# EAGLE design hdmi_lvds_converter (EAGLE 9.6.1)
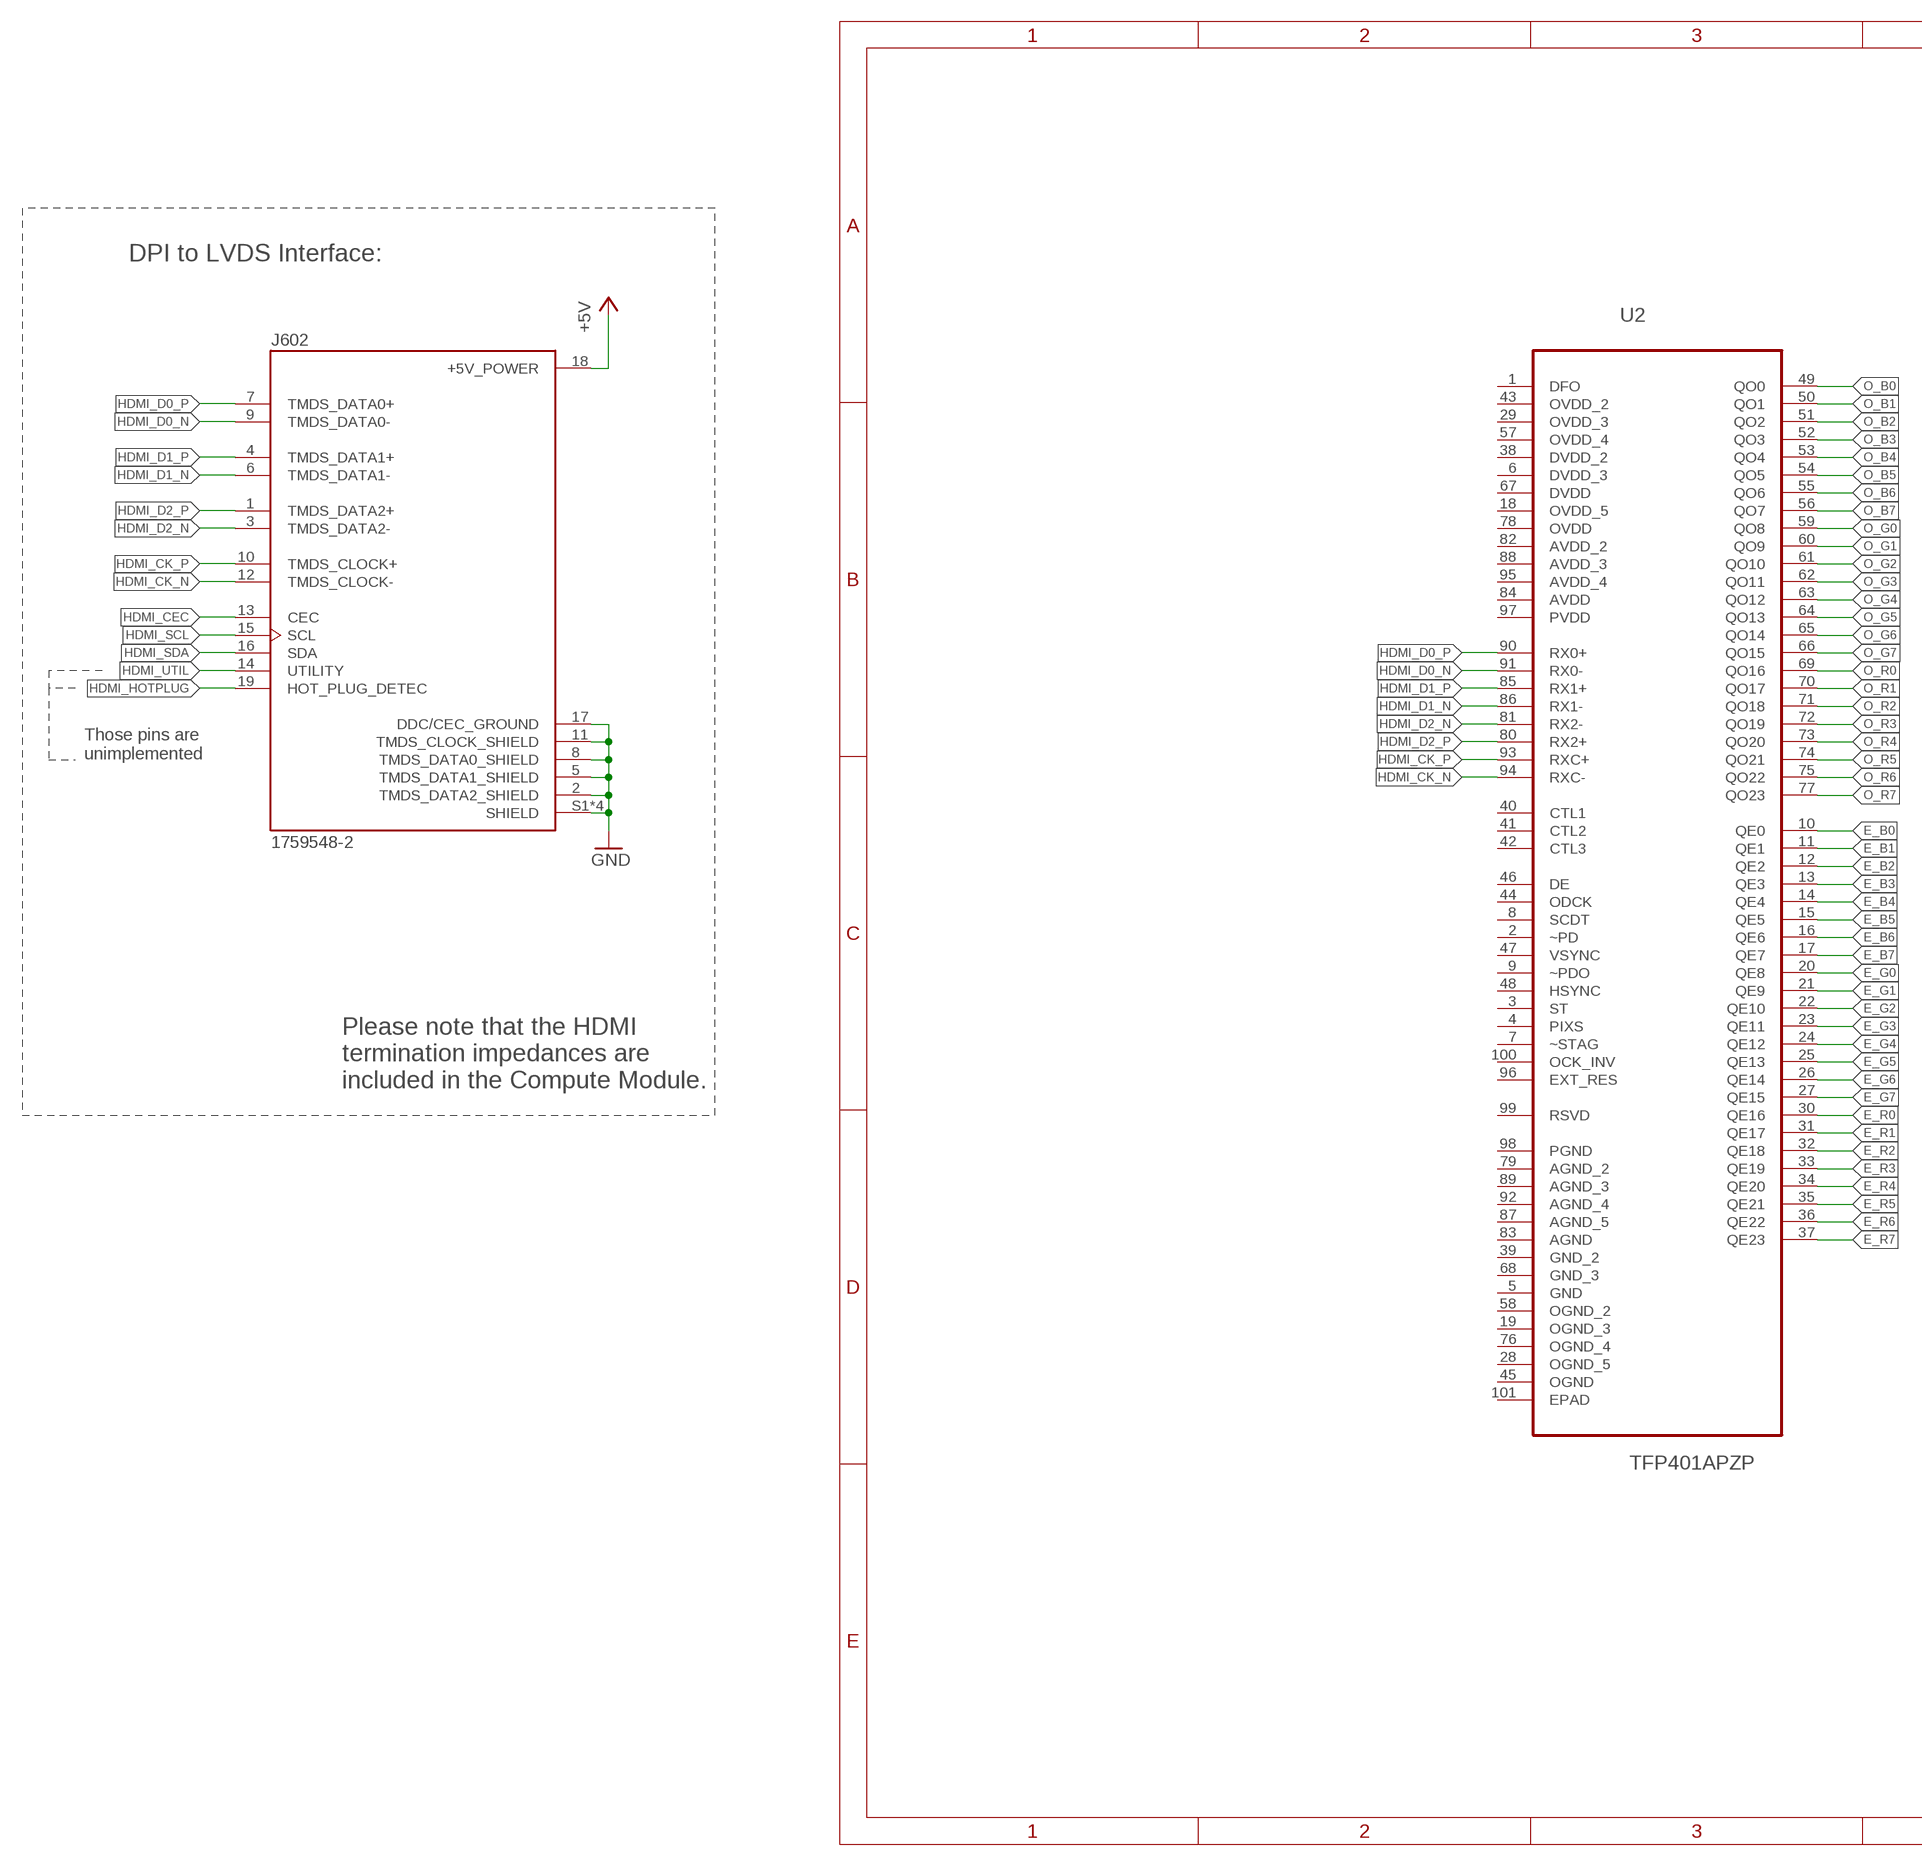
[diagram p0: schematic, sheet 1, part 1 of 2]
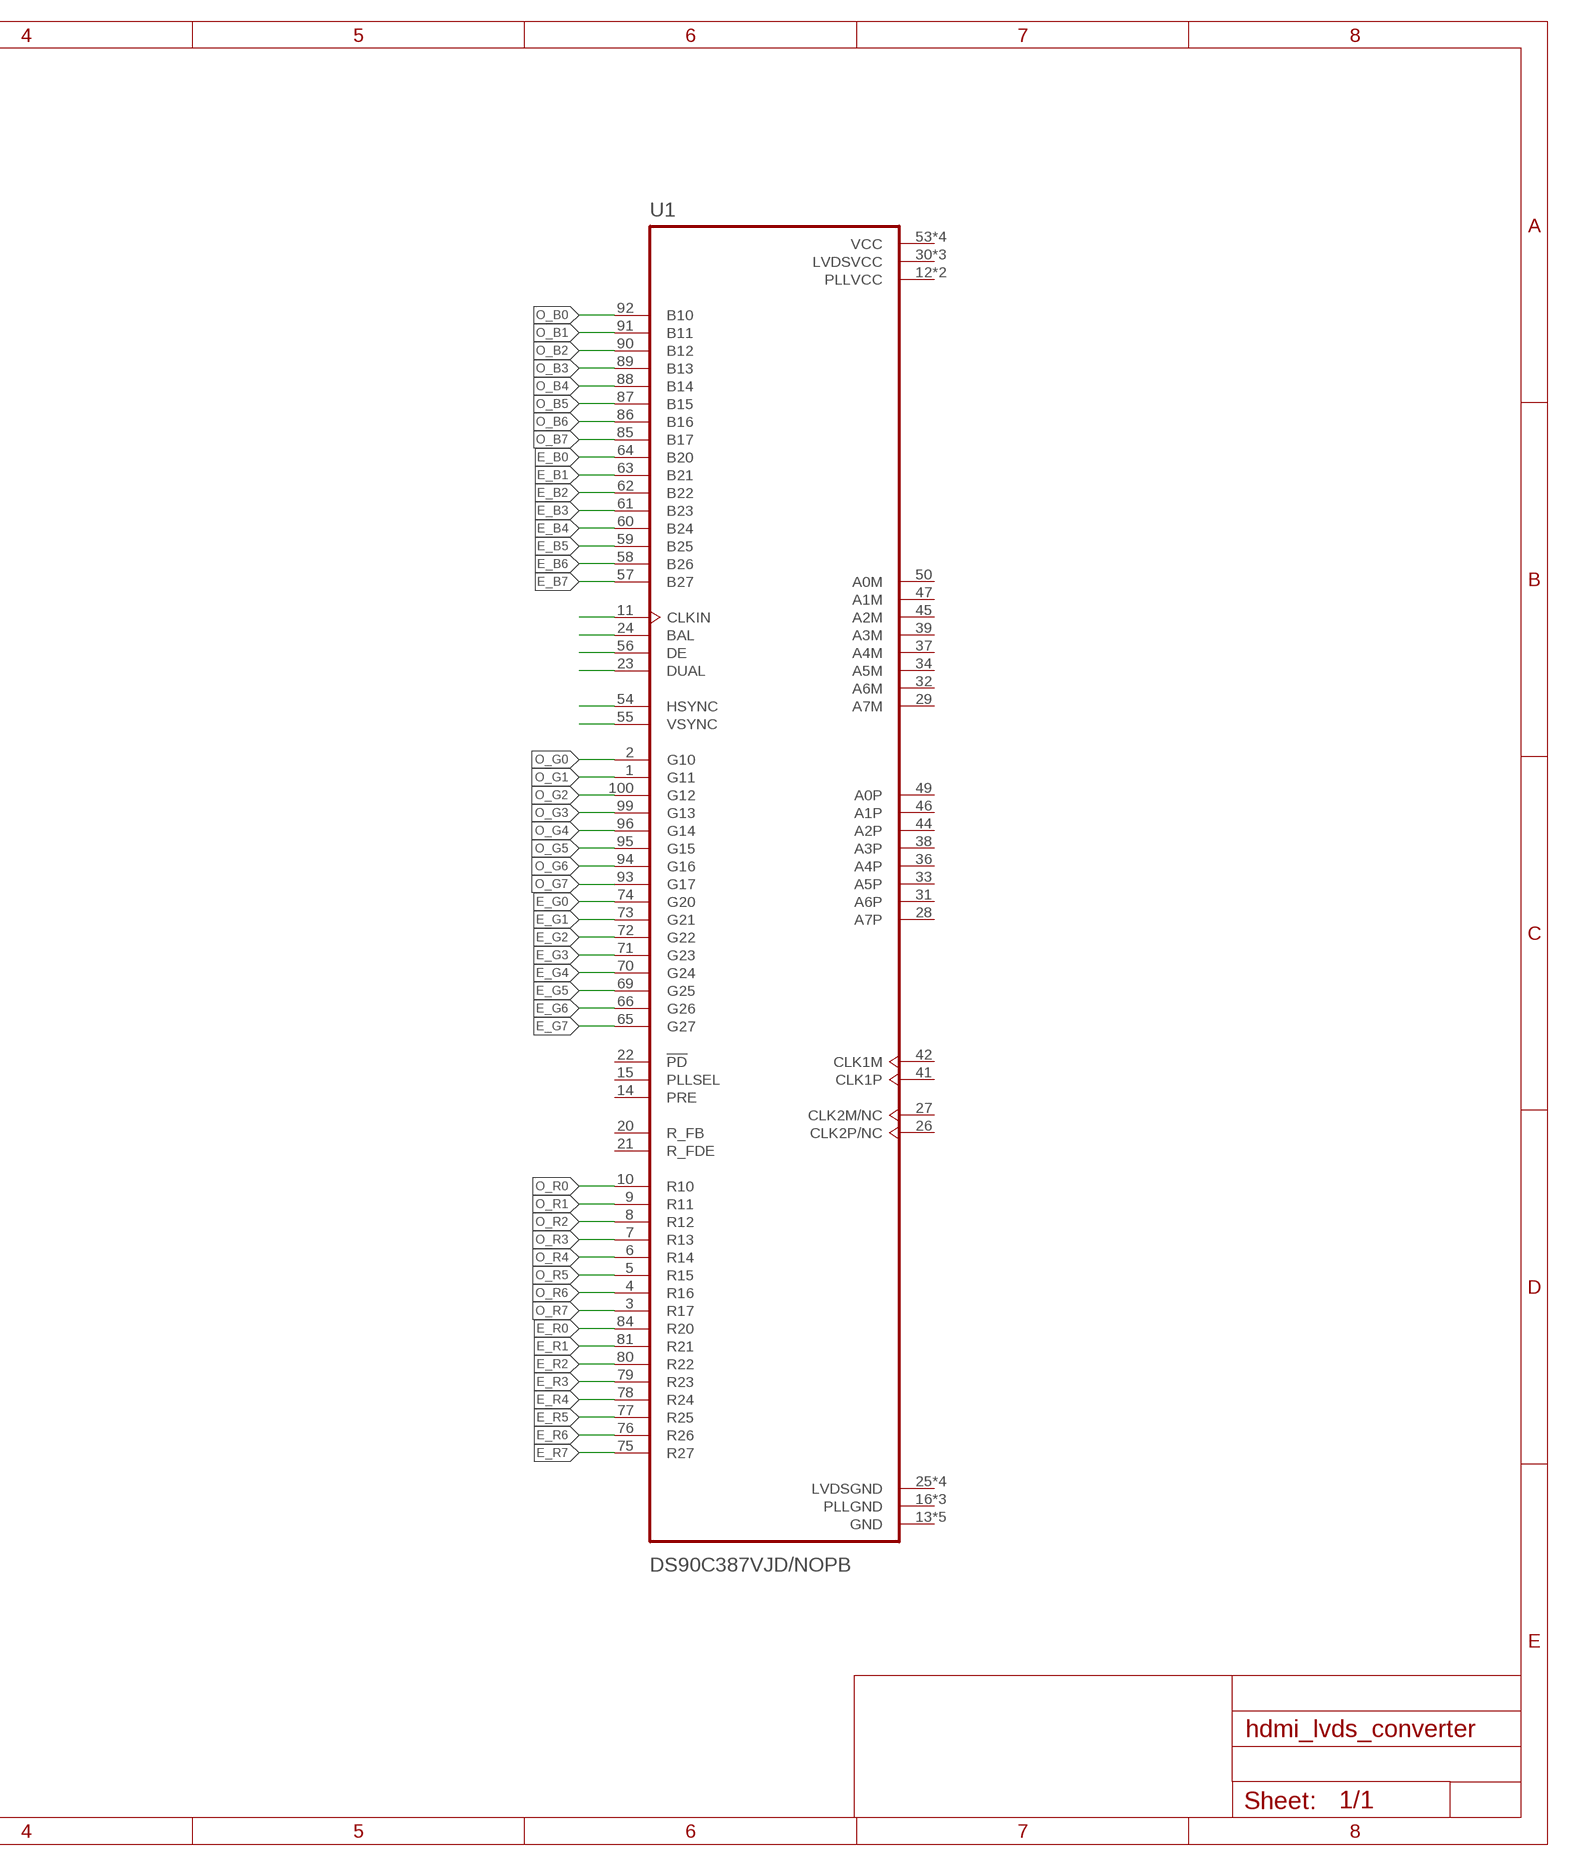
[diagram p1: schematic, sheet 1, part 2 of 2]

## Parts
J602  1759548-2  [TE_1759548-2]
U1  DS90C387VJD/NOPB  [QFP50P1600X1600X120-100N]
U2  TFP401APZP  [QFP50P1600X1600X120-101N]

## Nets
+5V: J602.18(+5V_POWER)
E_B0: U1.64(B20) U2.10(QE0)
E_B1: U1.63(B21) U2.11(QE1)
E_B2: U1.62(B22) U2.12(QE2)
E_B3: U1.61(B23) U2.13(QE3)
E_B4: U1.60(B24) U2.14(QE4)
E_B5: U1.59(B25) U2.15(QE5)
E_B6: U1.58(B26) U2.16(QE6)
E_B7: U1.57(B27) U2.17(QE7)
E_G0: U1.74(G20) U2.20(QE8)
E_G1: U1.73(G21) U2.21(QE9)
E_G2: U1.72(G22) U2.22(QE10)
E_G3: U1.71(G23) U2.23(QE11)
E_G4: U1.70(G24) U2.24(QE12)
E_G5: U1.69(G25) U2.25(QE13)
E_G6: U1.66(G26) U2.26(QE14)
E_G7: U1.65(G27) U2.27(QE15)
E_R0: U1.84(R20) U2.30(QE16)
E_R1: U1.81(R21) U2.31(QE17)
E_R2: U1.80(R22) U2.32(QE18)
E_R3: U1.79(R23) U2.33(QE19)
E_R4: U1.78(R24) U2.34(QE20)
E_R5: U1.77(R25) U2.35(QE21)
E_R6: U1.76(R26) U2.36(QE22)
E_R7: U1.75(R27) U2.37(QE23)
GND: J602.2(TMDS_DATA2_SHIELD) J602.5(TMDS_DATA1_SHIELD) J602.8(TMDS_DATA0_SHIELD) J602.11(TMDS_CLOCK_SHIELD) J602.17(DDC/CEC_GROUND) J602.S1(SHIELD) J602.S2(SHIELD) J602.S3(SHIELD) J602.S4(SHIELD)
HDMI_CEC: J602.13(CEC)
HDMI_CK_N: J602.12(TMDS_CLOCK-) U2.94(RXC-)
HDMI_CK_P: J602.10(TMDS_CLOCK+) U2.93(RXC+)
HDMI_D0_N: J602.9(TMDS_DATA0-) U2.91(RX0-)
HDMI_D0_P: J602.7(TMDS_DATA0+) U2.90(RX0+)
HDMI_D1_N: J602.6(TMDS_DATA1-) U2.86(RX1-)
HDMI_D1_P: J602.4(TMDS_DATA1+) U2.85(RX1+)
HDMI_D2_N: J602.3(TMDS_DATA2-) U2.81(RX2-)
HDMI_D2_P: J602.1(TMDS_DATA2+) U2.80(RX2+)
HDMI_HOTPLUG: J602.19(HOT_PLUG_DETEC)
HDMI_SCL: J602.15(SCL)
HDMI_SDA: J602.16(SDA)
HDMI_UTIL: J602.14(UTILITY)
N$57: U1.55(VSYNC)
N$58: U1.54(HSYNC)
N$59: U1.23(DUAL)
N$60: U1.56(DE)
N$61: U1.24(BAL)
N$62: U1.11(CLKIN)
O_B0: U1.92(B10) U2.49(QO0)
O_B1: U1.91(B11) U2.50(QO1)
O_B2: U1.90(B12) U2.51(QO2)
O_B3: U1.89(B13) U2.52(QO3)
O_B4: U1.88(B14) U2.53(QO4)
O_B5: U1.87(B15) U2.54(QO5)
O_B6: U1.86(B16) U2.55(QO6)
O_B7: U1.85(B17) U2.56(QO7)
O_G0: U1.2(G10) U2.59(QO8)
O_G1: U1.1(G11) U2.60(QO9)
O_G2: U1.100(G12) U2.61(QO10)
O_G3: U1.99(G13) U2.62(QO11)
O_G4: U1.96(G14) U2.63(QO12)
O_G5: U1.95(G15) U2.64(QO13)
O_G6: U1.94(G16) U2.65(QO14)
O_G7: U1.93(G17) U2.66(QO15)
O_R0: U1.10(R10) U2.69(QO16)
O_R1: U1.9(R11) U2.70(QO17)
O_R2: U1.8(R12) U2.71(QO18)
O_R3: U1.7(R13) U2.72(QO19)
O_R4: U1.6(R14) U2.73(QO20)
O_R5: U1.5(R15) U2.74(QO21)
O_R6: U1.4(R16) U2.75(QO22)
O_R7: U1.3(R17) U2.77(QO23)
Unconnected: U1.14(PRE) U1.15(PLLSEL) U1.20(R_FB) U1.21(R_FDE) U1.22(!PD) U1.26(CLK2P/NC) U1.27(CLK2M/NC) U1.28(A7P) U1.29(A7M) U1.30(LVDSVCC) U1.31(A6P) U1.32(A6M) U1.33(A5P) U1.34(A5M) U1.36(A4P) U1.37(A4M) U1.38(A3P) U1.39(A3M) U1.40(LVDSVCC) U1.41(CLK1P) U1.42(CLK1M) U1.44(A2P) U1.45(A2M) U1.46(A1P) U1.47(A1M) U1.48(LVDSVCC) U1.49(A0P) U1.50(A0M) U2.1(DFO) U2.2(~PD) U2.3(ST) U2.4(PIXS) U2.5(GND) U2.7(~STAG) U2.8(SCDT) U2.9(~PDO) U2.19(OGND_3) U2.28(OGND_5) U2.39(GND_2) U2.40(CTL1) U2.41(CTL2) U2.42(CTL3) U2.44(ODCK) U2.45(OGND) U2.46(DE) U2.47(VSYNC) U2.48(HSYNC) U2.58(OGND_2) U2.68(GND_3) U2.76(OGND_4) U2.79(AGND_2) U2.83(AGND) U2.87(AGND_5) U2.89(AGND_3) U2.92(AGND_4) U2.96(EXT_RES) U2.98(PGND) U2.99(RSVD) U2.100(OCK_INV) U2.101(EPAD)

## Notes on the sheet
- DPI to LVDS Interface:
- Those pins are
  unimplemented
- Please note that the HDMI
  termination impedances are 
  included in the Compute Module.

## Power pins joined to a net without a drawn wire
AVDD: U2.84(AVDD)
AVDD_2: U2.82(AVDD_2)
AVDD_3: U2.88(AVDD_3)
AVDD_4: U2.95(AVDD_4)
DVDD: U2.67(DVDD)
DVDD_2: U2.38(DVDD_2)
DVDD_3: U2.6(DVDD_3)
GND: U1.13(GND) U1.52(GND) U1.68(GND) U1.83(GND) U1.98(GND)
LVDSGND: U1.25(LVDSGND) U1.35(LVDSGND) U1.43(LVDSGND) U1.51(LVDSGND)
OVDD: U2.78(OVDD)
OVDD_2: U2.43(OVDD_2)
OVDD_3: U2.29(OVDD_3)
OVDD_4: U2.57(OVDD_4)
OVDD_5: U2.18(OVDD_5)
PLLGND: U1.16(PLLGND) U1.17(PLLGND) U1.19(PLLGND)
PLLVCC: U1.12(PLLVCC) U1.18(PLLVCC)
PVDD: U2.97(PVDD)
VCC: U1.53(VCC) U1.67(VCC) U1.82(VCC) U1.97(VCC)

## Library data of the parts
J602 = ND_main_control_unit:1759548-2: Conn HDMI RCP 19 POS 1mm Solder RA SMD 19 Terminal 1 Port T/R; AVAILABILITY: Unavailable; COMMENT: 1759548-2; DESCRIPTION: HDMI Receptacle Connector 19 Position Surface Mount, Right Angle; Through Hole; MF: TE Connectivity / AMP; MP: 1759548-2; PACKAGE: None; PRICE: None; TE_PURCHASE_URL: https://www.te.com/usa-en/product-1759548-2.html?te_bu=Cor&te_type=disp&te_campaign=seda_glo_cor-seda-global-disp-prtnr-fy19-seda-model-bom-cta_sma-317_1&elqCampaignId=32493
U1 = ND_main_control_unit:DS90C387VJD/NOPB: DS90C387VJD/NOPB: +3.3V Dual Pixel LVDS Display Interface (LDI)-SVGA/QXGA 100-TQFP -10 to 70 32.5 to 112/170MHz Clock Support Supports SVGA through QXGA Panel Resolutions Dual Pixel Architecture ProgrammableTransmitter Data and Control Please refer to the Datasheet <http://www.ti.com/lit/ds/symlink/ds90c387.pdf> for more information.; DISTRIBUTOR: Mouser; DISTRIBUTOR_REF: 926-DS90C387VJD/NOPB; MANUFACTURER: TI; MANUFACTURER_REF: DS90C387VJD/NOPB
U2 = ND_main_control_unit:TFP401APZP: TFP401x: PanelBus(TM) Digital Receiver Supports Pixel Rates up to 165 MHz(Including 1080p and WUXGA at 60 Hz) Digital Visual Interface(DVI) Specification Compliant True-Color, 24-Bit/Pixel, 16.7MColors at 1 or 2 Pixels per Clock Laser Trimmed Internal Termination Resistors for Optimum Fixed Impedance Matching Please refer to the Datasheet <http://www.ti.com/lit/ds/symlink/tfp401a.pdf?HQS=TI-null-null-mousermode-df-pf-null-wwe&ts=1591281857482> for more information.; DISTRIBUTOR: Unavailable; DISTRIBUTOR_REF: 0/3 Receiver 100-HTQFP _14x14_; MANUFACTURER: Texas Instruments; MANUFACTURER_REF: TFP401APZP

## Board
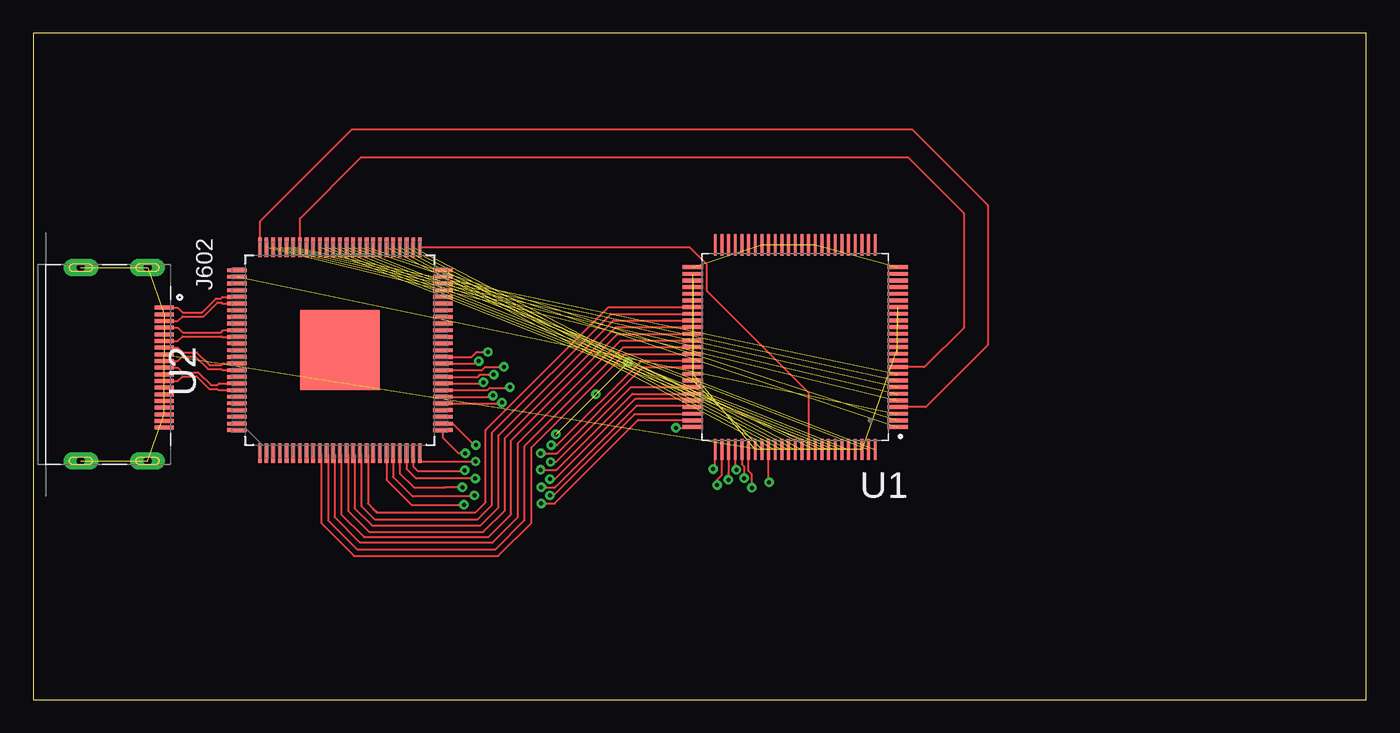
[diagram p2: board, top side]
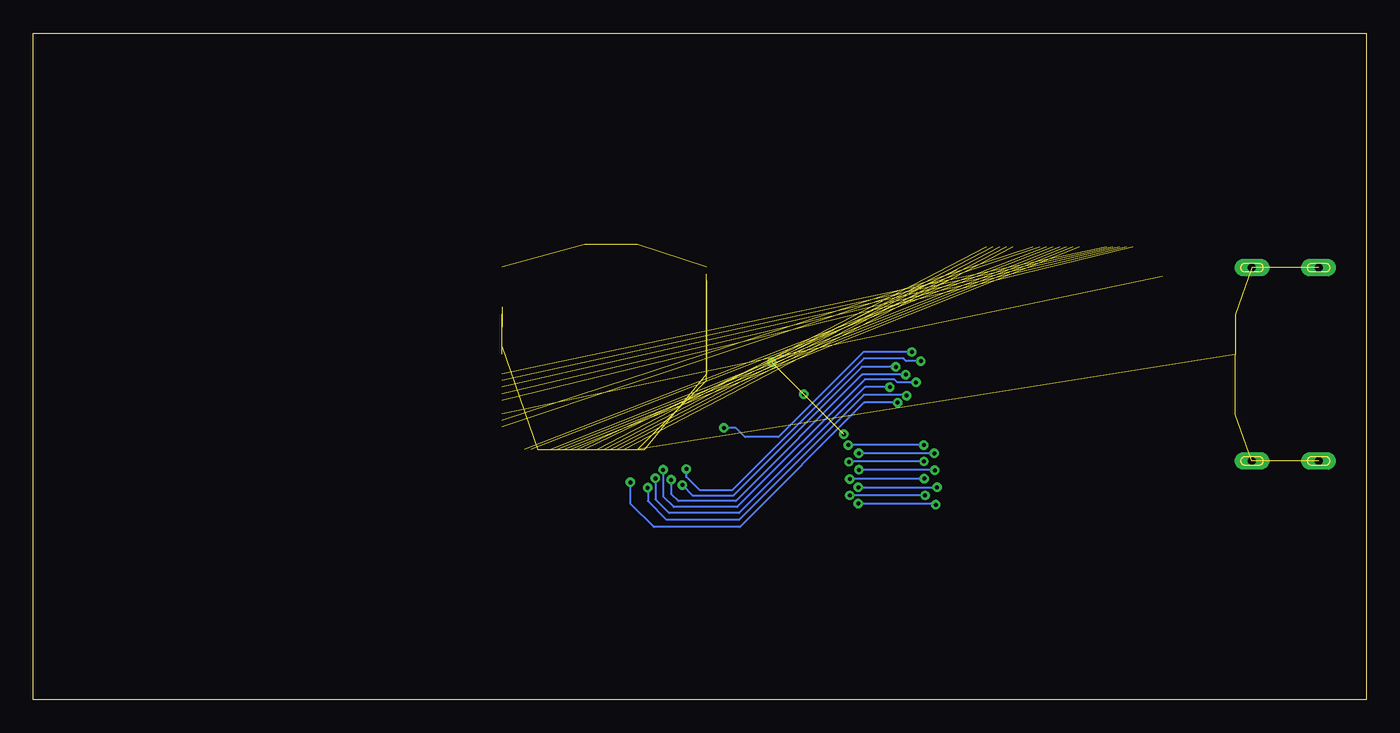
[diagram p3: board, bottom side, seen from below]

Size 100 x 50 mm. Coordinates in mm from the lower left corner, seen from the top.
Outline: 0,0 100,0 100,50 0,50 0,0
Copper layers (1+2*15+16): Top 0.035mm / dielectric 0.15mm / Route2 0.035mm / dielectric 1.5mm / Route15 0.035mm / dielectric 0.2mm / Bottom 0.035mm
Design rules "ND_PCBWay_4layers_basic": minimum track width 6mil, minimum drill 0.3mm, track to track 6mil, track to pad 6mil, pad to pad 6mil, via to via 6mil, smd to smd 6mil, copper to edge 20mil, drill to drill 6mil, minimum pad ring 10mil, minimum via ring 8mil, stop-mask expansion 4mil, vias tented up to drill 0.5mm, thermal gap 10mil

### Footprints (pad centres in the part's own frame; a part is rotated, then mirrored left to right if it is on the bottom)
TE_1759548-2 = smd 0.3 x 1.45: 1 -4.25,4.5; 2 -3.75,4.5; 3 -3.25,4.5; 4 -2.75,4.5; 5 -2.25,4.5; 6 -1.75,4.5; 7 -1.25,4.5; 8 -0.75,4.5; 9 -0.25,4.5; 10 0.25,4.5; 11 0.75,4.5; 12 1.25,4.5; 13 1.75,4.5; 14 2.25,4.5; 15 2.75,4.5; 16 3.25,4.5; 17 3.75,4.5; 18 4.25,4.5; 19 4.75,4.5 | drill 0.6 pad 1.3 long: S1 7.25,3.25; S2 -7.25,3.25; S3 -7.25,-1.75; S4 7.25,-1.75
QFP50P1600X1600X120-100N = smd 1.6 x 0.28: 1 -7.68,6; 2 -7.68,5.5; 3 -7.68,5; 4 -7.68,4.5; 5 -7.68,4; 6 -7.68,3.5; 7 -7.68,3; 8 -7.68,2.5; 9 -7.68,2; 10 -7.68,1.5; 11 -7.68,1; 12 -7.68,0.5; 13 -7.68,0; 14 -7.68,-0.5; 15 -7.68,-1; 16 -7.68,-1.5; 17 -7.68,-2; 18 -7.68,-2.5; 19 -7.68,-3; 20 -7.68,-3.5; 21 -7.68,-4; 22 -7.68,-4.5; 23 -7.68,-5; 24 -7.68,-5.5; 25 -7.68,-6; 51 7.68,-6; 52 7.68,-5.5; 53 7.68,-5; 54 7.68,-4.5; 55 7.68,-4; 56 7.68,-3.5; 57 7.68,-3; 58 7.68,-2.5; 59 7.68,-2; 60 7.68,-1.5; 61 7.68,-1; 62 7.68,-0.5; 63 7.68,0; 64 7.68,0.5; 65 7.68,1; 66 7.68,1.5; 67 7.68,2; 68 7.68,2.5; 69 7.68,3; 70 7.68,3.5; 71 7.68,4; 72 7.68,4.5; 73 7.68,5; 74 7.68,5.5; 75 7.68,6 | smd 0.28 x 1.6: 26 -6,-7.68; 27 -5.5,-7.68; 28 -5,-7.68; 29 -4.5,-7.68; 30 -4,-7.68; 31 -3.5,-7.68; 32 -3,-7.68; 33 -2.5,-7.68; 34 -2,-7.68; 35 -1.5,-7.68; 36 -1,-7.68; 37 -0.5,-7.68; 38 0,-7.68; 39 0.5,-7.68; 40 1,-7.68; 41 1.5,-7.68; 42 2,-7.68; 43 2.5,-7.68; 44 3,-7.68; 45 3.5,-7.68; 46 4,-7.68; 47 4.5,-7.68; 48 5,-7.68; 49 5.5,-7.68; 50 6,-7.68; 76 6,7.68; 77 5.5,7.68; 78 5,7.68; 79 4.5,7.68; 80 4,7.68; 81 3.5,7.68; 82 3,7.68; 83 2.5,7.68; 84 2,7.68; 85 1.5,7.68; 86 1,7.68; 87 0.5,7.68; 88 0,7.68; 89 -0.5,7.68; 90 -1,7.68; 91 -1.5,7.68; 92 -2,7.68; 93 -2.5,7.68; 94 -3,7.68; 95 -3.5,7.68; 96 -4,7.68; 97 -4.5,7.68; 98 -5,7.68; 99 -5.5,7.68; 100 -6,7.68
QFP50P1600X1600X120-101N = smd 1.473 x 0.279: 1 -7.722,5.994; 2 -7.722,5.512; 3 -7.722,5.004; 4 -7.722,4.496; 5 -7.722,3.988; 6 -7.722,3.505; 7 -7.722,2.997; 8 -7.722,2.489; 9 -7.722,2.007; 10 -7.722,1.499; 11 -7.722,0.991; 12 -7.722,0.508; 13 -7.722,0; 14 -7.722,-0.508; 15 -7.722,-0.991; 16 -7.722,-1.499; 17 -7.722,-2.007; 18 -7.722,-2.489; 19 -7.722,-2.997; 20 -7.722,-3.505; 21 -7.722,-3.988; 22 -7.722,-4.496; 23 -7.722,-5.004; 24 -7.722,-5.512; 25 -7.722,-5.994; 51 7.722,-5.994; 52 7.722,-5.512; 53 7.722,-5.004; 54 7.722,-4.496; 55 7.722,-3.988; 56 7.722,-3.505; 57 7.722,-2.997; 58 7.722,-2.489; 59 7.722,-2.007; 60 7.722,-1.499; 61 7.722,-0.991; 62 7.722,-0.508; 63 7.722,0; 64 7.722,0.508; 65 7.722,0.991; 66 7.722,1.499; 67 7.722,2.007; 68 7.722,2.489; 69 7.722,2.997; 70 7.722,3.505; 71 7.722,3.988; 72 7.722,4.496; 73 7.722,5.004; 74 7.722,5.512; 75 7.722,5.994 | smd 0.279 x 1.473: 26 -5.994,-7.722; 27 -5.512,-7.722; 28 -5.004,-7.722; 29 -4.496,-7.722; 30 -3.988,-7.722; 31 -3.505,-7.722; 32 -2.997,-7.722; 33 -2.489,-7.722; 34 -2.007,-7.722; 35 -1.499,-7.722; 36 -0.991,-7.722; 37 -0.508,-7.722; 38 0,-7.722; 39 0.508,-7.722; 40 0.991,-7.722; 41 1.499,-7.722; 42 2.007,-7.722; 43 2.489,-7.722; 44 2.997,-7.722; 45 3.505,-7.722; 46 3.988,-7.722; 47 4.496,-7.722; 48 5.004,-7.722; 49 5.512,-7.722; 50 5.994,-7.722; 76 5.994,7.722; 77 5.512,7.722; 78 5.004,7.722; 79 4.496,7.722; 80 3.988,7.722; 81 3.505,7.722; 82 2.997,7.722; 83 2.489,7.722; 84 2.007,7.722; 85 1.499,7.722; 86 0.991,7.722; 87 0.508,7.722; 88 0,7.722; 89 -0.508,7.722; 90 -0.991,7.722; 91 -1.499,7.722; 92 -2.007,7.722; 93 -2.489,7.722; 94 -2.997,7.722; 95 -3.505,7.722; 96 -3.988,7.722; 97 -4.496,7.722; 98 -5.004,7.722; 99 -5.512,7.722; 100 -5.994,7.722 | smd 5.994 x 5.994: 101 0,0

### Placement (x,y rotation side)
J602  5.32,25.16 270 top
U1  57.16,26.45 180 top
U2  23,26.22 90 top

### Tracks (layer width: path | path; a pad name or v marks a point on that pad's centre or on a via)
E_B0
  Top 0.152: U1.64 44.4,25.95 37.37,18.92 37.37,13.27 34.88,10.78 24.07,10.78 21.6,13.24 21.6,18.4 U2.10
E_B1
  Top 0.152: U1.63 44.28,26.45 36.87,19.03 36.87,13.48 34.67,11.28 24.28,11.28 22.11,13.45 22.11,18.4 U2.11
E_B2
  Top 0.152: U1.62 44.06,26.95 36.36,19.25 36.36,13.69 34.46,11.79 24.49,11.79 22.59,13.69 22.59,18.4 U2.12
E_B3
  Top 0.152: U1.61 43.84,27.45 35.85,19.45 35.85,13.9 34.15,12.2 24.8,12.2 23.1,13.9 23.1,18.4 U2.13
E_B4
  Top 0.152: U2.14 23.61,18.4 23.61,14.16 25.2,12.57 33.75,12.57 35.38,14.2 35.38,19.63 43.7,27.95 U1.60
E_B5
  Top 0.152: U2.15 24.09,18.4 24.09,14.36 25.4,13.05 33.55,13.05 34.9,14.4 34.9,19.83 43.52,28.45 U1.59
E_B6
  Top 0.152: U2.16 24.6,18.4 24.6,14.54 25.6,13.54 33.35,13.54 34.41,14.6 34.41,20.03 43.34,28.95 U1.58
E_B7
  Top 0.152: U2.17 25.11,18.4 25.11,14.71 25.51,14.31 25.71,14.11 | U1.57 43.15,29.45 33.93,20.23 33.93,14.8 33.15,14.02 25.8,14.02 | 25.71,14.11 25.8,14.02 | 25.8,14.02 25.71,14.11
E_G0  (via drill 0.3)
  Top 0.152: v32.3,14.61 28.38,14.61 26.5,16.48 U2.20 | v38.1,14.71 39.11,14.71 45.38,20.98 48.84,20.98 48.87,20.95 U1.74
  Bottom 0.152: v38.1,14.71 32.4,14.71 v32.3,14.61
E_G1  (via drill 0.3)
  Top 0.152: U2.21 26.99,16.71 28.46,15.23 33.01,15.23 v33.1,15.32 | v38.75,15.32 39.02,15.32 45.1,21.4 49.43,21.4 U1.73
  Bottom 0.152: v33.1,15.32 v38.75,15.32
E_G2  (via drill 0.3)
  Top 0.152: U2.22 27.5,16.98 28.56,15.92 30.9,15.92 30.91,15.93 v32.2,15.93 | v38.1,15.93 39.13,15.93 45.25,22.05 49.38,22.05 U1.72
  Bottom 0.152: v32.2,15.93 32.21,15.92 37.55,15.92 37.56,15.93 v38.1,15.93
E_G3  (via drill 0.3)
  Top 0.152: U2.23 28,17.31 28.72,16.59 v33.15,16.59 | v38.75,16.54 39.14,16.54 45.15,22.55 49.38,22.55 U1.71
  Bottom 0.152: v38.75,16.54 38.7,16.59 v33.15,16.59
E_G4  (via drill 0.3)
  Top 0.152: U2.24 28.51,17.48 28.82,17.17 32.28,17.17 32.3,17.2 v32.37,17.2 | v38.06,17.25 39.25,17.25 44.95,22.95 U1.70
  Bottom 0.152: v32.37,17.2 32.42,17.25 v38.06,17.25
E_G5  (via drill 0.3)
  Top 0.152: U2.25 28.99,17.95 29.12,17.82 33.13,17.82 v33.18,17.87 | v38.8,17.83 39.23,17.83 44.85,23.45 U1.69
  Bottom 0.152: v33.18,17.87 38.73,17.87 38.77,17.83 v38.8,17.83
E_G6  (via drill 0.3)
  Top 0.152: U2.26 30.72,19.65 31.89,18.48 v32.4,18.48 | v38.07,18.48 39.28,18.48 45.75,24.95 U1.66
  Bottom 0.152: v32.4,18.48 v38.07,18.48
E_G7  (via drill 0.3)
  Top 0.152: U2.27 31.44,20.71 33.05,19.1 v33.2,19.1 | v38.85,19.1 39.3,19.1 45.65,25.45 U1.65
  Bottom 0.152: v33.2,19.1 v38.85,19.1
E_R0  (via drill 0.3)
  Top 0.152: U2.30 35.18,22.23 35.2,22.25 v35.16,22.29 | v55.2,16.3 55.16,16.34 U1.84
  Bottom 0.152: v35.16,22.29 37.66,22.29 47,12.95 53.45,12.95 55.2,14.7 v55.2,16.3
E_R1  (via drill 0.3)
  Top 0.152: U2.31 34.41,22.71 34.48,22.78 v34.48,22.81 | v53.91,15.9 53.91,16.89 53.66,17.14 U1.81
  Bottom 0.152: v34.48,22.81 34.53,22.87 37.68,22.87 47.05,13.49 52.49,13.49 53.9,14.9 v53.9,15.89 v53.91,15.9
E_R2  (via drill 0.3)
  Top 0.152: U2.32 34.06,23.22 34.24,23.4 35.75,23.4 v35.75,23.45 | U1.80 53.16,17.66 53.32,17.49 v53.32,16.6
  Bottom 0.152: v35.75,23.45 37.6,23.45 47.05,14 52.3,14 53.32,15.02 v53.32,16.6
E_R3  (via drill 0.3)
  Top 0.152: U2.33 33.63,23.73 33.7,23.8 v33.77,23.8 | U1.79 52.66,17.34 v52.74,17.26 v52.74,17.25
  Bottom 0.152: v33.77,23.8 35.18,23.8 35.41,24.03 37.62,24.03 47.2,14.45 51.95,14.45 52.74,15.24 v52.74,17.25
E_R4  (via drill 0.3)
  Top 0.152: U2.34 33.36,24.21 33.53,24.39 34.49,24.39 34.5,24.4 34.53,24.4 v34.54,24.39 | U1.78 52.16,17.02 52.14,17 v52.14,16.5
  Bottom 0.152: v34.54,24.39 37.81,24.39 47.3,14.9 51.6,14.9 52.14,15.44 v52.14,16.5
E_R5  (via drill 0.3)
  Top 0.152: U2.35 33.65,24.72 33.9,24.97 v35.3,24.97 | v51.3,16.1 51.3,16.5 51.66,16.86 U1.77
  Bottom 0.152: v35.3,24.97 37.83,24.97 47.5,15.3 50.5,15.3 v51.3,16.1
E_R6  (via drill 0.3)
  Top 0.152: U2.36 33.41,25.23 v33.41,25.4 | v51,17.3 51.16,17.46 U1.76
  Bottom 0.152: v33.41,25.4 34.51,25.4 34.71,25.6 37.7,25.6 47.6,15.7 50,15.7 51,16.7 v51,17.3
E_R7  (via drill 0.3)
  Top 0.152: U2.37 32.9,25.71 33.27,26.08 v34.1,26.08 | v48.2,20.4 49.43,20.4 U1.75
  Bottom 0.152: v34.1,26.08 37.72,26.08 44.1,19.7 46.6,19.7 47.3,20.4 v48.2,20.4
GND  (13 unrouted)
HDMI_CK_N
  Top 0.152: J602.12 10.85,23.91 11.2,24.26 12.24,24.26 13.21,23.3 13.8,23.3 13.87,23.22 U2.94
HDMI_CK_P
  Top 0.152: J602.10 10.85,24.91 11.2,24.56 12.37,24.56 13.33,23.6 13.8,23.6 13.93,23.73 U2.93
HDMI_D0_N
  Top 0.152: J602.9 10.85,25.41 11.2,25.76 12.14,25.76 13.11,24.8 14.1,24.8 14.17,24.72 U2.91
HDMI_D0_P
  Top 0.152: J602.7 10.85,26.41 11.2,26.06 11.3,26.06 12.27,26.06 13.23,25.1 14.1,25.1 14.23,25.23 U2.90
HDMI_D1_N
  Top 0.152: J602.6 10.85,26.91 11.2,27.26 14.1,27.26 14.15,27.21 U2.86
HDMI_D1_P
  Top 0.152: J602.4 10.85,27.91 11.2,27.56 14.1,27.56 14.26,27.72 U2.85
HDMI_D2_N
  Top 0.152: J602.3 10.85,28.41 11.2,28.76 12.79,28.76 13.83,29.8 14.1,29.8 14.18,29.73 U2.81
HDMI_D2_P
  Top 0.152: J602.1 10.85,29.41 11.2,29.06 12.66,29.06 13.71,30.11 14.1,30.11 14.2,30.21 U2.80
LVDSGND  (3 unrouted)
N$1  (via drill 0.3)  (2 unrouted)
  other vias: 39.2,19.9 42.2,22.9 44.6,25.3
O_B0  (1 unrouted)
O_B1  (1 unrouted)
O_B2
  Top 0.152: U2.51 49.23,33.94 50.51,32.66 50.51,30.69 58.16,23.04 U1.90
O_B3  (1 unrouted)
O_B4  (1 unrouted)
O_B5  (1 unrouted)
O_B6  (1 unrouted)
O_B7  (1 unrouted)
O_G0  (1 unrouted)
O_G1  (1 unrouted)
O_G2  (1 unrouted)
O_G3  (1 unrouted)
O_G4  (1 unrouted)
O_G5  (1 unrouted)
O_G6  (1 unrouted)
O_G7  (1 unrouted)
O_R0
  Top 0.152: U2.69 20,36.1 24.6,40.7 65.6,40.7 69.8,36.5 69.8,27.9 66.85,24.95 U1.10
O_R1  (1 unrouted)
O_R2  (1 unrouted)
O_R3  (1 unrouted)
O_R4  (1 unrouted)
O_R5  (1 unrouted)
O_R6
  Top 0.152: U2.75 17.01,35.91 23.9,42.8 65.9,42.8 71.6,37.1 71.6,26.6 66.95,21.95 U1.4
O_R7  (1 unrouted)
PLLGND  (2 unrouted)
PLLVCC  (1 unrouted)
VCC  (3 unrouted)